# Altium schematic sheet 5_传感器.SchDoc
size A4
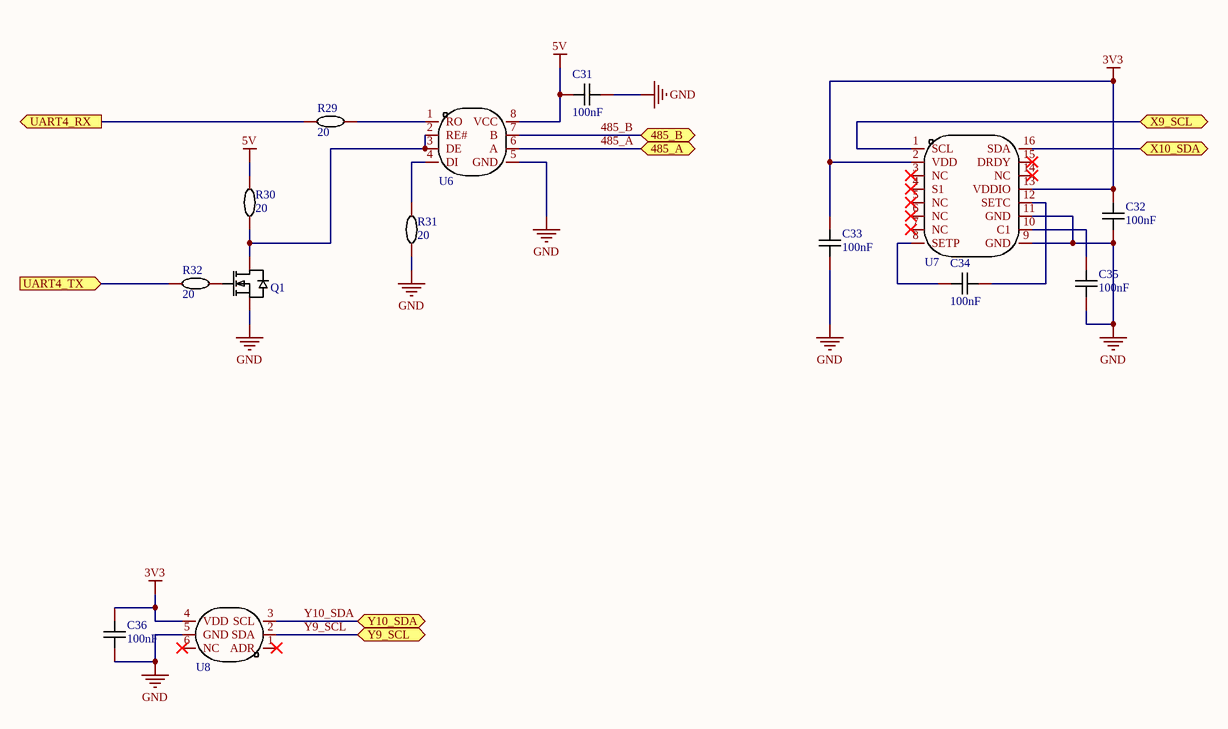
[diagram p0: 5_传感器.SchDoc]

## Parts
C31  100nF  [0402C]
C32  100nF  [0402C]
C33  100nF  [0402C]
C34  100nF  [0402C]
C35  100nF  [0402C]
C36  100nF  [0402C]
Q1  2N7002  [SOT-23-3_L2.9-W1.3-P1.90-LS2.4-BR]  (value not drawn)
R29  20  [0402R]
R30  20  [0402R]
R31  20  [0402R]
R32  20  [0402R]
U6  MAX3485ECSA+  [SOIC-8_L4.9-W3.9-P1.27-LS6.0-BL]  (value not drawn)
U7  QMC5883L  [LGA-16_L3.0-W3.0-P0.50-BL_SQ]  (value not drawn)
U8  AHT10  [SENSOR-SMD_AHT10]  (value not drawn)

## Ports
485_A (bidir), 485_B (bidir), UART4_RX (out), UART4_TX (in), X9_SCL (bidir), X10_SDA (bidir), Y9_SCL (bidir), Y10_SDA (bidir)

## Nets
3V3: C32.1 C33.2 C36.1 U7.2(VDD) U7.13(VDDIO) U8.4(VDD)
5V: C31.2 R30.2 U6.8(VCC)
GND: C31.1 C32.2 C33.1 C35.2 C36.2 Q1.2(S) R31.1 U6.5(GND) U7.9(GND) U7.11(GND) U8.5(GND)
485_A: U6.6(A) ; port 485_A
485_B: U6.7(B) ; port 485_B
UART4_RX: R29.1 ; port UART4_RX
UART4_TX: R32.1 ; port UART4_TX
X9_SCL: U7.1(SCL) ; port X9_SCL
X10_SDA: U7.16(SDA) ; port X10_SDA
Y9_SCL: U8.2(SDA) ; port Y9_SCL
Y10_SDA: U8.3(SCL) ; port Y10_SDA
NetC34_1: C34.1 U7.12(SETC)
NetC34_2: C34.2 U7.8(SETP)
NetC35_1: C35.1 U7.10(C1)
NetQ1_3: Q1.3(D) R30.1 U6.2(RE#) U6.3(DE)
NetR29_2: R29.2 U6.1(RO)
NetR31_2: R31.2 U6.4(DI)

Not connected (* = marked no-connect by the designer): Q1 1(G); R32 2; U7 3(NC)* 4(S1)* 5(NC)* 6(NC)* 7(NC)* 14(NC)* 15(DRDY)*; U8 1(ADR)* 6(NC)*

## Library data of the parts
C31-C36 = CAP_0402: Symbol: CapAcitance; Convert to PCB: yes; Device: CAP_0402; Add into BOM: yes; Supplier Footprint: 0402; Value: 100nF; Name: 100nF
Q1 = 2N7002_C8545: Add into BOM: yes; Drain Source Voltage (Vdss): 60V; Continuous Drain Current (Id): 115mA; Power Dissipation (Pd): 200mW; Gate Threshold Voltage (Vgs(th)@Id): 2.5V@250uA; Symbol: 2N7002; Device: 2N7002_C8545; Supplier Part: C8545; Manufacturer Part: 2N7002; Supplier Footprint: SOT-23; JLCPCB Part Class: Basic Part; Datasheet: https://atta.szlcsc.com/upload/public/pdf/source/20170302/1488422688078.pdf; Supplier: LCSC; Convert to PCB: yes; Name: 2N7002
R29-R32 = Res_0402: Convert to PCB: yes; Device: Res_0402; Add into BOM: yes; Supplier Footprint: 0402; Value: 20; Name: 20
U6 = MAX3485ECSA+: Add into BOM: yes; Symbol: MAX3485ECSA+; Device: MAX3485ECSA+; LCSC Part Name: MAX3485ECSA+; Supplier Part: C3235169; Manufacturer Part: MAX3485ECSA+; Supplier Footprint: SOIC-8; Datasheet: https://atta.szlcsc.comnull; Supplier: LCSC; Convert to PCB: yes; Name: MAX3485ECSA+
U7 = QMC5883L: Add into BOM: yes; Symbol: QMC5883L; Device: QMC5883L; Supplier Part: C976032; Manufacturer Part: QMC5883L; Supplier Footprint: LGA-16(3x3x0.9); JLCPCB Part Class: Extended Part; Datasheet: https://atta.szlcsc.com/upload/public/pdf/source/20201217/C976032_5B9A2F3901E175046CBA037B1F18A1F2.pdf; Supplier: LCSC; Convert to PCB: yes; Name: QMC5883L
U8 = AHT10: Add into BOM: yes; Symbol: AHT10; Device: AHT10; LCSC Part Name: AHT10; Supplier Part: C368909; Manufacturer Part: AHT10; Supplier Footprint: SMD; JLCPCB Part Class: Extended Part; Datasheet: https://atta.szlcsc.com/upload/public/pdf/source/20190129/C368909_B294364A5189322D50DF5028F78C32FD.pdf; Supplier: LCSC; Convert to PCB: yes; Name: AHT10